# EAGLE schematic open1541 (EAGLE 5.01)
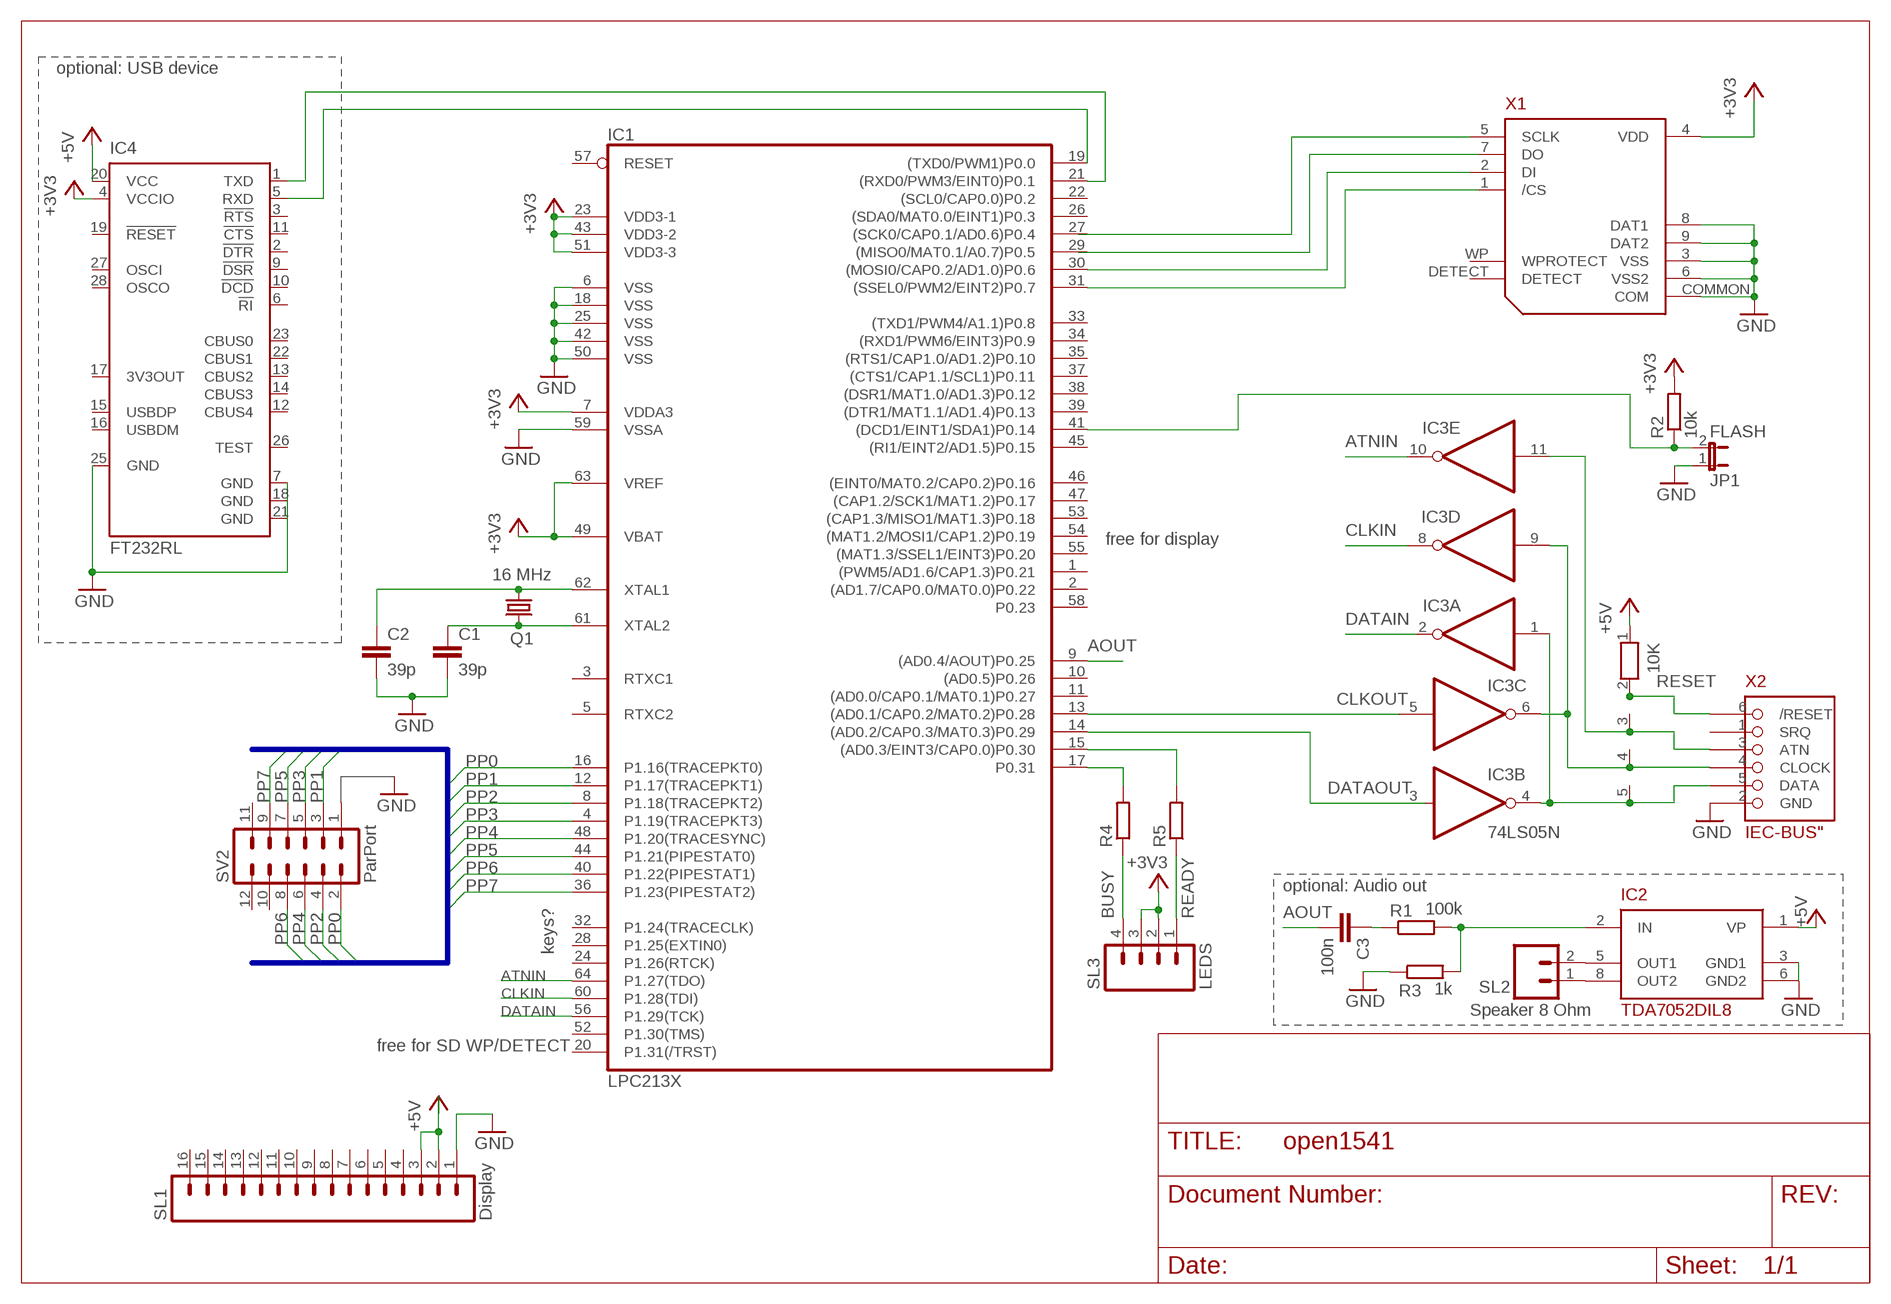
[diagram p0: schematic, sheet 1]

## Parts
10K  RN04  [RN-5]
C1  39p  C-EU050-024X044  [C050-024X044]
C2  39p  C-EU050-024X044  [C050-024X044]
C3  100n  C-EU050-024X044  [C050-024X044]
IC1  LPC213X  [SQFP-S-10X10-64]
IC2  TDA7052DIL8  [DIL8]
IC3  74LS05N  [DIL14]
IC4  FT232RL  [SSOP28]
JP1  FLASH  JP1E  [JP1]
Q1  16 MHz  CRYSTALHC49S  [HC49/S]
R1  100k  R-EU_0204/7  [0204/7]
R2  10k  R-EU_0204/7  [0204/7]
R3  1k  R-EU_0204/7  [0204/7]
R4  R-EU_0204/7  [0204/7]
R5  R-EU_0204/7  [0204/7]
SL1  Display  M16  [16P]
SL2  Speaker 8 Ohm  M02  [02P]
SL3  LEDS  M04  [04P]
SV2  ParPort  MA06-2  [MA06-2]
X1  DM1B-DSF-PEJ(22)"  [DM1B-DSF-PEJ(22)]
X2  IEC-BUS"  [DIN45322-PRINT]

## Nets
+3V3: IC1.7(VDDA3) IC1.23(VDD3-1) IC1.43(VDD3-2) IC1.49(VBAT) IC1.51(VDD3-3) IC1.63(VREF) IC4.4(VCCIO) R2.2 SL3.2 SL3.3 X1.4(VDD)
+5V: 10K.1 IC2.1(VP) IC4.20(VCC) SL1.2 SL1.3
AOUT: C3.2 IC1.9((AD0.4/AOUT)P0.25)
ATNIN: IC1.64(P1.27(TDO)) IC3.10(E:O)
BUSY: R4.1 SL3.4
CLKIN: IC1.60(P1.28(TDI)) IC3.8(D:O)
CLKOUT: IC1.13((AD0.1/CAP0.2/MAT0.2)P0.28) IC3.5(C:I)
DATAIN: IC1.56(P1.29(TCK))
DATAOUT: IC1.14((AD0.2/CAP0.3/MAT0.3)P0.29)
GND: C1.2 C2.2 IC1.6(VSS) IC1.18(VSS) IC1.25(VSS) IC1.42(VSS) IC1.50(VSS) IC1.59(VSSA) IC2.3(GND1) IC2.6(GND2) IC4.7(GND) IC4.18(GND) IC4.21(GND) IC4.25(GND) JP1.1 R3.1 SL1.1 X1.3(VSS) X1.6(VSS2) X1.8(DAT1) X1.9(DAT2) X1.COMMON(COM) X2.2(GND)
IECATN: 10K.3 IC3.11(E:I) X2.3(ATN)
IECCLOCK: 10K.4 IC3.6(C:O) IC3.9(D:I) X2.4(CLOCK)
IECDATA: 10K.5 IC3.1(A:I) IC3.4(B:O) X2.5(DATA)
N$2: IC1.30((MOSI0/CAP0.2/AD1.0)P0.6) X1.2(DI)
N$3: IC1.31((SSEL0/PWM2/EINT2)P0.7)
N$5: C1.1 IC1.61(XTAL2) Q1.2
N$6: C2.1 IC1.62(XTAL1) Q1.1
N$7: IC1.41((DCD1/EINT1/SDA1)P0.14) JP1.2 R2.1
N$8: R3.2
N$9: IC2.8(OUT2) SL2.1
N$10: IC2.5(OUT1) SL2.2
N$12: IC2.2(IN) R1.2
N$13: C3.1 R1.1
N$14: IC1.19((TXD0/PWM1)P0.0) IC4.5(RXD)
N$15: IC1.17(P0.31) R4.2
N$17: IC1.21((RXD0/PWM3/EINT0)P0.1) IC4.1(TXD)
N$18: IC1.15((AD0.3/EINT3/CAP0.0)P0.30) R5.2
PP0: IC1.16(P1.16(TRACEPKT0)) SV2.2
PP1: IC1.12(P1.17(TRACEPKT1)) SV2.3
PP2: IC1.8(P1.18(TRACEPKT2)) SV2.4
PP3: IC1.4(P1.19(TRACEPKT3)) SV2.5
PP4: IC1.48(P1.20(TRACESYNC)) SV2.6
PP5: IC1.44(P1.21(PIPESTAT0)) SV2.7
PP6: IC1.40(P1.22(PIPESTAT1)) SV2.8
PP7: IC1.36(P1.23(PIPESTAT2)) SV2.9
READY: R5.1 SL3.1
RESET: 10K.2 X2.6(/RESET)
Unconnected: IC1.1((PWM5/AD1.6/CAP1.3)P0.21) IC1.2((AD1.7/CAP0.0/MAT0.0)P0.22) IC1.3(RTXC1) IC1.5(RTXC2) IC1.10((AD0.5)P0.26) IC1.11((AD0.0/CAP0.1/MAT0.1)P0.27) IC1.20(P1.31(/TRST)) IC1.22((SCL0/CAP0.0)P0.2) IC1.24(P1.26(RTCK)) IC1.26((SDA0/MAT0.0/EINT1)P0.3) IC1.27((SCK0/CAP0.1/AD0.6)P0.4) IC1.28(P1.25(EXTIN0)) IC1.29((MISO0/MAT0.1/A0.7)P0.5) IC1.32(P1.24(TRACECLK)) IC1.33((TXD1/PWM4/A1.1)P0.8) IC1.34((RXD1/PWM6/EINT3)P0.9) IC1.35((RTS1/CAP1.0/AD1.2)P0.10) IC1.37((CTS1/CAP1.1/SCL1)P0.11) IC1.38((DSR1/MAT1.0/AD1.3)P0.12) IC1.39((DTR1/MAT1.1/AD1.4)P0.13) IC1.45((RI1/EINT2/AD1.5)P0.15) IC1.46((EINT0/MAT0.2/CAP0.2)P0.16) IC1.47((CAP1.2/SCK1/MAT1.2)P0.17) IC1.52(P1.30(TMS)) IC1.53((CAP1.3/MISO1/MAT1.3)P0.18) IC1.54((MAT1.2/MOSI1/CAP1.2)P0.19) IC1.55((MAT1.3/SSEL1/EINT3)P0.20) IC1.57(RESET) IC1.58(P0.23) IC3.2(A:O) IC3.3(B:I) IC3.12(F:O) IC3.13(F:I) IC4.2(!DTR) IC4.3(!RTS) IC4.6(!RI) IC4.9(!DSR) IC4.10(!DCD) IC4.11(!CTS) IC4.12(CBUS4) IC4.13(CBUS2) IC4.14(CBUS3) IC4.15(USBDP) IC4.16(USBDM) IC4.17(3V3OUT) IC4.19(!RESET) IC4.22(CBUS1) IC4.23(CBUS0) IC4.26(TEST) IC4.27(OSCI) IC4.28(OSCO) SL1.4 SL1.5 SL1.6 SL1.7 SL1.8 SL1.9 SL1.10 SL1.11 SL1.12 SL1.13 SL1.14 SL1.15 SL1.16 SV2.1 SV2.10 SV2.11 SV2.12 X1.1(/CS) X1.5(SCLK) X1.7(DO) X1.DETECT X1.WP(WPROTECT) X2.1(SRQ)

## Buses
PP[0..7]

## Notes on the sheet
- optional: USB device
- free for display
- optional: Audio out
- keys?
- free for SD WP/DETECT

## Power pins joined to a net without a drawn wire
GND: IC3.7(P:GND)
VCC: IC3.14(P:VCC)

## Library data of the parts
10K = resistor-net:RN04: RESISTOR NETWORK
C1-C3 = resistor:C-EU: CAPACITOR, European symbol
IC1 = lpc213x:LPC213X
IC2 = open1541:TDA7052: Phillips TDA7052 1 W BTL mono audio amplifier
IC3 = 74xx-eu:74*05: Hex INVERTER, open collector
IC4 = ftdichip:FT232R: Source: http://www.ftdichip.com/Documents/DataSheets/DS_FT232R_v104.pdf
JP1 = jumper:JP1E: JUMPER
Q1 = crystal:CRYSTAL: CRYSTAL
R1-R5 = resistor:R-EU_: RESISTOR, European symbol
SL1 = con-amp-quick:M16: AMP QUICK CONNECTOR
SL2 = con-amp-quick:M02: AMP QUICK CONNECTOR
SL3 = con-amp-quick:M04: AMP QUICK CONNECTOR
SV2 = con-lstb:MA06-2: PIN HEADER
X1 = open1541:DM1B-DSF-PEJ(22): DM1B-DSF-PEJ(22) Hirose SD card connector, reverse type. Digikey number HR846CT-ND
X2 = open1541:IEC-BUS: IEC bus connector